# Altium project STM32F103RCT6_DAUGHTER_BOARD.PrjPcb
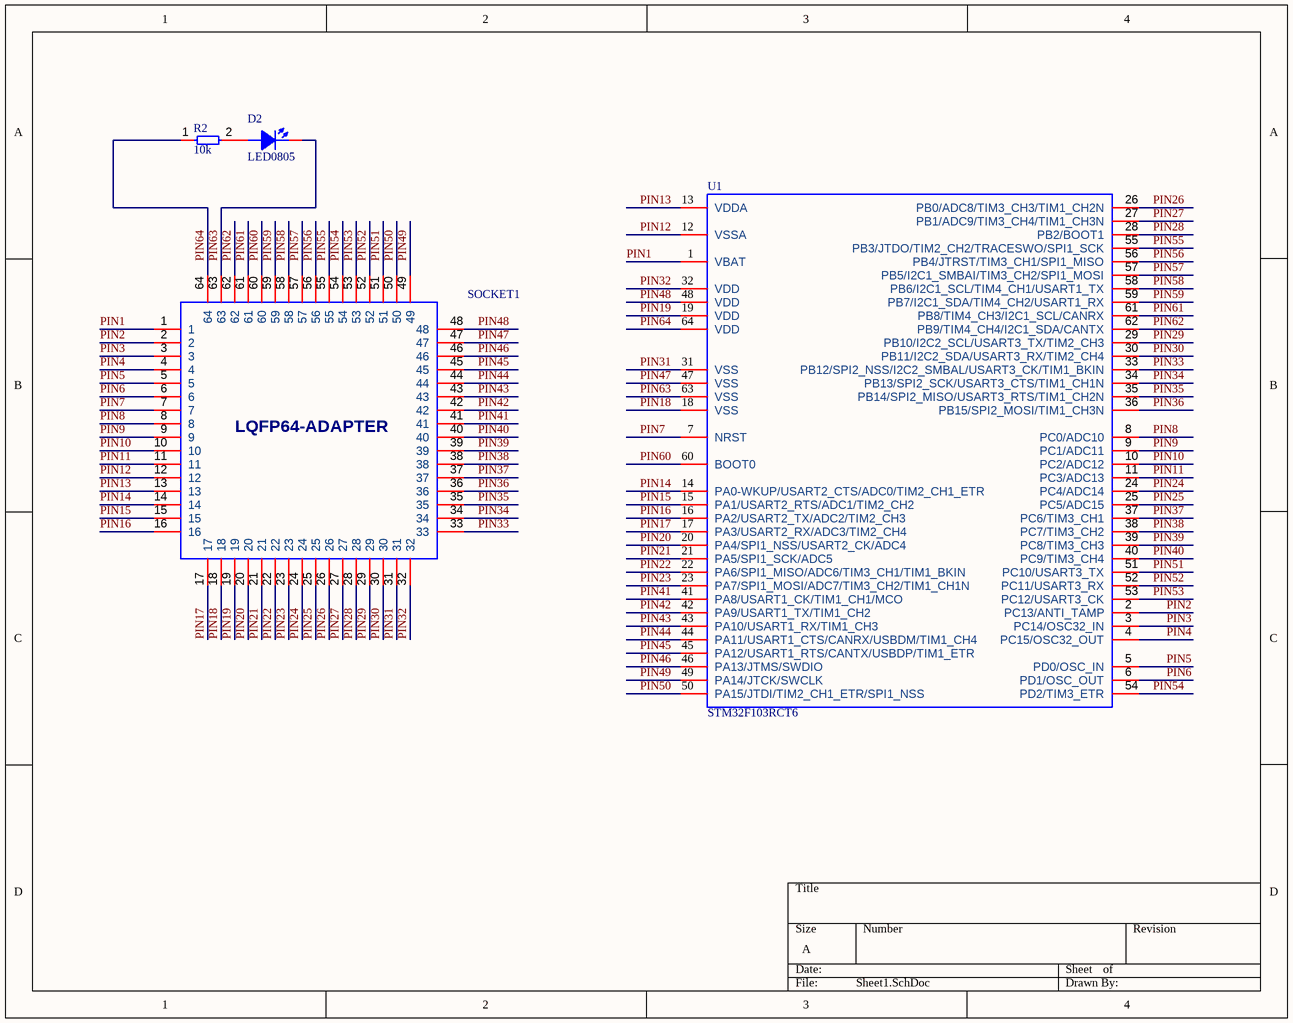
[diagram p0: Sheet1.SchDoc]
1 sheet, 4 parts. Net scope: global (net labels, ports and power ports of the same name join across sheets).
Board files: PCB2.PcbDoc, PCB4.PcbDoc

## Sheet Sheet1.SchDoc
size A

### Parts
D2  LED0805  [L0805RED]
R2  10k  [R0805]
SOCKET1  SOCKET-ADAPTER-OTQ-64-05-03  [SOCKET-ADAPTER-OTQ-64-05-03]  (value not drawn)
U1  STM32F103RCT6  [LQFP064_FPT-64P-M03]

### Nets
PIN1: SOCKET1.1 U1.1(VBAT)
PIN2: SOCKET1.2 U1.2(PC13/ANTI_TAMP)
PIN3: SOCKET1.3 U1.3(PC14/OSC32_IN)
PIN4: SOCKET1.4 U1.4(PC15/OSC32_OUT)
PIN5: SOCKET1.5 U1.5(PD0/OSC_IN)
PIN6: SOCKET1.6 U1.6(PD1/OSC_OUT)
PIN7: SOCKET1.7 U1.7(NRST)
PIN8: SOCKET1.8 U1.8(PC0/ADC10)
PIN9: SOCKET1.9 U1.9(PC1/ADC11)
PIN10: SOCKET1.10 U1.10(PC2/ADC12)
PIN11: SOCKET1.11 U1.11(PC3/ADC13)
PIN12: SOCKET1.12 U1.12(VSSA)
PIN13: SOCKET1.13 U1.13(VDDA)
PIN14: SOCKET1.14 U1.14(PA0-WKUP/USART2_CTS/ADC0/TIM2_CH1_ETR)
PIN15: SOCKET1.15 U1.15(PA1/USART2_RTS/ADC1/TIM2_CH2)
PIN16: SOCKET1.16 U1.16(PA2/USART2_TX/ADC2/TIM2_CH3)
PIN17: SOCKET1.17 U1.17(PA3/USART2_RX/ADC3/TIM2_CH4)
PIN18: SOCKET1.18 U1.18(VSS)
PIN19: SOCKET1.19 U1.19(VDD)
PIN20: SOCKET1.20 U1.20(PA4/SPI1_NSS/USART2_CK/ADC4)
PIN21: SOCKET1.21 U1.21(PA5/SPI1_SCK/ADC5)
PIN22: SOCKET1.22 U1.22(PA6/SPI1_MISO/ADC6/TIM3_CH1/TIM1_BKIN)
PIN23: SOCKET1.23 U1.23(PA7/SPI1_MOSI/ADC7/TIM3_CH2/TIM1_CH1N)
PIN24: SOCKET1.24 U1.24(PC4/ADC14)
PIN25: SOCKET1.25 U1.25(PC5/ADC15)
PIN26: SOCKET1.26 U1.26(PB0/ADC8/TIM3_CH3/TIM1_CH2N)
PIN27: SOCKET1.27 U1.27(PB1/ADC9/TIM3_CH4/TIM1_CH3N)
PIN28: SOCKET1.28 U1.28(PB2/BOOT1)
PIN29: SOCKET1.29 U1.29(PB10/I2C2_SCL/USART3_TX/TIM2_CH3)
PIN30: SOCKET1.30 U1.30(PB11/I2C2_SDA/USART3_RX/TIM2_CH4)
PIN31: SOCKET1.31 U1.31(VSS)
PIN32: SOCKET1.32 U1.32(VDD)
PIN33: SOCKET1.33 U1.33(PB12/SPI2_NSS/I2C2_SMBAL/USART3_CK/TIM1_BKIN)
PIN34: SOCKET1.34 U1.34(PB13/SPI2_SCK/USART3_CTS/TIM1_CH1N)
PIN35: SOCKET1.35 U1.35(PB14/SPI2_MISO/USART3_RTS/TIM1_CH2N)
PIN36: SOCKET1.36 U1.36(PB15/SPI2_MOSI/TIM1_CH3N)
PIN37: SOCKET1.37 U1.37(PC6/TIM3_CH1)
PIN38: SOCKET1.38 U1.38(PC7/TIM3_CH2)
PIN39: SOCKET1.39 U1.39(PC8/TIM3_CH3)
PIN40: SOCKET1.40 U1.40(PC9/TIM3_CH4)
PIN41: SOCKET1.41 U1.41(PA8/USART1_CK/TIM1_CH1/MCO)
PIN42: SOCKET1.42 U1.42(PA9/USART1_TX/TIM1_CH2)
PIN43: SOCKET1.43 U1.43(PA10/USART1_RX/TIM1_CH3)
PIN44: SOCKET1.44 U1.44(PA11/USART1_CTS/CANRX/USBDM/TIM1_CH4)
PIN45: SOCKET1.45 U1.45(PA12/USART1_RTS/CANTX/USBDP/TIM1_ETR)
PIN46: SOCKET1.46 U1.46(PA13/JTMS/SWDIO)
PIN47: SOCKET1.47 U1.47(VSS)
PIN48: SOCKET1.48 U1.48(VDD)
PIN49: SOCKET1.49 U1.49(PA14/JTCK/SWCLK)
PIN50: SOCKET1.50 U1.50(PA15/JTDI/TIM2_CH1_ETR/SPI1_NSS)
PIN51: SOCKET1.51 U1.51(PC10/USART3_TX)
PIN52: SOCKET1.52 U1.52(PC11/USART3_RX)
PIN53: SOCKET1.53 U1.53(PC12/USART3_CK)
PIN54: SOCKET1.54 U1.54(PD2/TIM3_ETR)
PIN55: SOCKET1.55 U1.55(PB3/JTDO/TIM2_CH2/TRACESWO/SPI1_SCK)
PIN56: SOCKET1.56 U1.56(PB4/JTRST/TIM3_CH1/SPI1_MISO)
PIN57: SOCKET1.57 U1.57(PB5/I2C1_SMBAI/TIM3_CH2/SPI1_MOSI)
PIN58: SOCKET1.58 U1.58(PB6/I2C1_SCL/TIM4_CH1/USART1_TX)
PIN59: SOCKET1.59 U1.59(PB7/I2C1_SDA/TIM4_CH2/USART1_RX)
PIN60: SOCKET1.60 U1.60(BOOT0)
PIN61: SOCKET1.61 U1.61(PB8/TIM4_CH3/I2C1_SCL/CANRX)
PIN62: SOCKET1.62 U1.62(PB9/TIM4_CH4/I2C1_SDA/CANTX)
PIN63: D2.2(K) SOCKET1.63 U1.63(VSS)
PIN64: R2.1 SOCKET1.64 U1.64(VDD)
NetD2_1: D2.1(A) R2.2

### Notes on the sheet
- (in symbol SOCKET-ADAPTER-OTQ-64-05-03) LQFP64-ADAPTER

### Library data of the parts
R2 = Resistor SMD
U1 = STM32F103RCT6: LQFP64